# EAGLE design bravo-v2 (EAGLE 9.0.1)

## Sheet 1 of 2
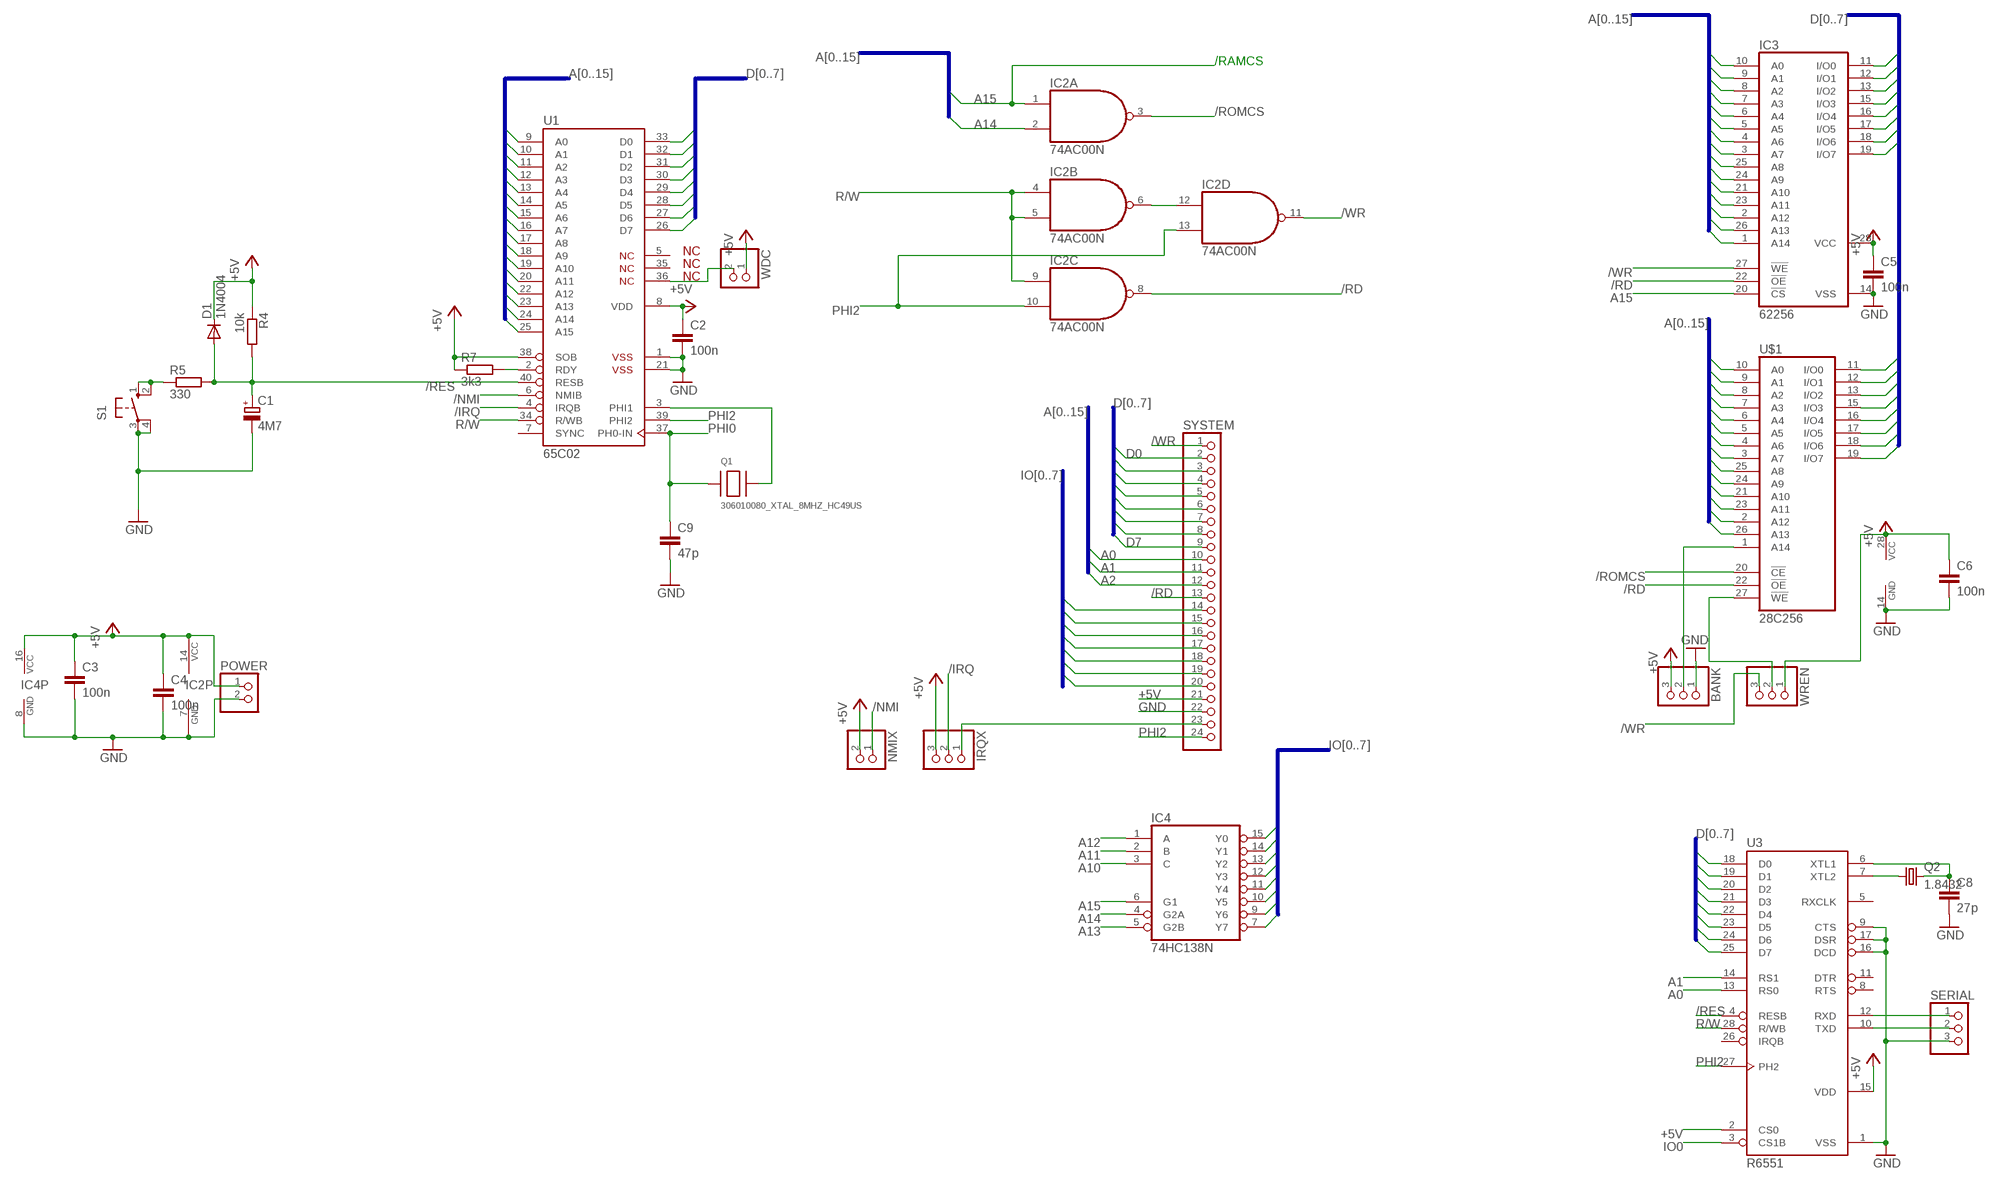
[diagram p0: schematic, sheet 1]

### Parts
BANK  PINHD-1X3  [1X03]
C1  4M7  CPOL-EUE2.5-6  [E2,5-6]
C2  100n  C-EU025-030X050  [C025-030X050]
C3  100n  C-EU025-030X050  [C025-030X050]
C4  100n  C-EU025-030X050  [C025-030X050]
C5  100n  C-EU025-030X050  [C025-030X050]
C6  100n  C-EU025-030X050  [C025-030X050]
C8  27p  C-EU050-030X075  [C050-030X075]
C9  47p  C-EU025-030X050  [C025-030X050]
D1  1N4004  [DO41-10]
IC2  74AC00N  74ALS00N  [DIL14]
IC3  62256  62256P  [DIL28-6]
IC4  74HC138N  [DIL16]
IRQX  PINHD-1X3  [1X03]
NMIX  PINHD-1X2  [1X02]
POWER  PINHD-1X2  [1X02]
Q1  306010080_XTAL_8MHZ_HC49US  [HC49US]
Q2  1.8432  CRYSTALHC49S  [HC49/S]
R4  10k  R-EU_0207/7  [0207/7]
R5  330  R-EU_0207/7  [0207/7]
R7  3k3  R-EU_0207/7  [0207/7]
S1  40-XX  [B3F-40XX]
SERIAL  PINHD-1X3  [1X03]
SYSTEM  PINHD-1X24/90  [1X24/90]
U1  65C02  G65SC02P  [DIP-40]
U3  R6551  G65SC51P  [DIP-28]
U$1  28C256  [DIL28]
WDC  PINHD-1X2  [1X02]
WREN  PINHD-1X3  [1X03]

### Nets
+5V [supply]: BANK.3 C2.1 C3.1 C4.1 C5.1 C6.1 D1.C IC2.14(P:VCC) IC3.28(VCC) IC4.16(VCC) IRQX.3 NMIX.2 POWER.1 R4.1 R7.1 SYSTEM.21 U1.8(VDD) U1.38(SOB) U3.2(CS0) U3.15(VDD) U$1.28(VCC) WDC.1 WREN.1
/IRQ: IRQX.2 U1.4(IRQB)
/NMI: NMIX.1 U1.6(NMIB)
/RD: IC2.8(C:O) IC3.22(!OE) SYSTEM.13 U$1.22(!OE)
/RES: C1.+ D1.A R4.2 R5.2 U1.40(RESB) U3.4(RESB)
/ROMCS: IC2.3(A:O) U$1.20(!CE)
/WR: IC2.11(D:O) IC3.27(!WE) SYSTEM.1 WREN.3
A0: IC3.10(A0) SYSTEM.10 U1.9(A0) U3.13(RS0) U$1.10(A0)
A1: IC3.9(A1) SYSTEM.11 U1.10(A1) U3.14(RS1) U$1.9(A1)
A2: IC3.8(A2) SYSTEM.12 U1.11(A2) U$1.8(A2)
A3: IC3.7(A3) U1.12(A3) U$1.7(A3)
A4: IC3.6(A4) U1.13(A4) U$1.6(A4)
A5: IC3.5(A5) U1.14(A5) U$1.5(A5)
A6: IC3.4(A6) U1.15(A6) U$1.4(A6)
A7: IC3.3(A7) U1.16(A7) U$1.3(A7)
A8: IC3.25(A8) U1.17(A8) U$1.25(A8)
A9: IC3.24(A9) U1.18(A9) U$1.24(A9)
A10: IC3.21(A10) IC4.3(C) U1.19(A10) U$1.21(A10)
A11: IC3.23(A11) IC4.2(B) U1.20(A11) U$1.23(A11)
A12: IC3.2(A12) IC4.1(A) U1.22(A12) U$1.2(A12)
A13: IC3.26(A13) IC4.5(G2B) U1.23(A13) U$1.26(A13)
A14: IC2.2(A:I1) IC3.1(A14) IC4.4(G2A) U1.24(A14)
A15: IC2.1(A:I0) IC3.20(!CS) IC4.6(G1) U1.25(A15)
D0: IC3.11(I/O0) SYSTEM.2 U1.33(D0) U3.18(D0) U$1.11(I/O0)
D1: IC3.12(I/O1) SYSTEM.3 U1.32(D1) U3.19(D1) U$1.12(I/O1)
D2: IC3.13(I/O2) SYSTEM.4 U1.31(D2) U3.20(D2) U$1.13(I/O2)
D3: IC3.15(I/O3) SYSTEM.5 U1.30(D3) U3.21(D3) U$1.15(I/O3)
D4: IC3.16(I/O4) SYSTEM.6 U1.29(D4) U3.22(D4) U$1.16(I/O4)
D5: IC3.17(I/O5) SYSTEM.7 U1.28(D5) U3.23(D5) U$1.17(I/O5)
D6: IC3.18(I/O6) SYSTEM.8 U1.27(D6) U3.24(D6) U$1.18(I/O6)
D7: IC3.19(I/O7) SYSTEM.9 U1.26(D7) U3.25(D7) U$1.19(I/O7)
GND [supply]: BANK.1 C1.- C2.2 C3.2 C4.2 C5.2 C6.2 C8.2 C9.2 IC2.7(P:GND) IC3.14(VSS) IC4.8(GND) POWER.2 S1.3(P) S1.4(P1) SERIAL.3 SYSTEM.22 U1.1(VSS$1) U1.21(VSS$2) U3.1(VSS) U3.9(CTS) U3.16(DCD) U3.17(DSR) U$1.14(GND)
IO0: IC4.15(Y0) U3.3(CS1B)
IO1: IC4.14(Y1) SYSTEM.14
IO2: IC4.13(Y2) SYSTEM.15
IO3: IC4.12(Y3) SYSTEM.16
IO4: IC4.11(Y4) SYSTEM.17
IO5: IC4.10(Y5) SYSTEM.18
IO6: IC4.9(Y6) SYSTEM.19
IO7: IC4.7(Y7) SYSTEM.20
N$1: R5.1 S1.1(S) S1.2(S1)
N$8: U1.36(NC$3) WDC.2
N$9: BANK.2 U$1.1(A14)
N$10: IC2.6(B:O) IC2.12(D:I0)
N$11: R7.2 U1.2(RDY)
N$31: U$1.27(!WE) WREN.2
N$32: IRQX.1 SYSTEM.23
N$33: Q1.P$2 U1.3(PHI1)
N$35: SERIAL.1 U3.12(RXD)
N$36: SERIAL.2 U3.10(TXD)
N$38: Q2.1 U3.7(XTL2)
N$39: C8.1 Q2.2 U3.6(XTL1)
PHI0: C9.1 Q1.P$1 U1.37(PH0-IN)
PHI2: IC2.10(C:I1) IC2.13(D:I1) SYSTEM.24 U1.39(PHI2) U3.27(PH2)
R/W: IC2.4(B:I0) IC2.5(B:I1) IC2.9(C:I0) U1.34(R/WB) U3.28(R/WB)
Unconnected: U1.5(NC$1) U1.7(SYNC) U1.35(NC$2) U3.5(RXCLK) U3.8(RTS) U3.11(DTR) U3.26(IRQB)

### Buses
A[0..15]
D[0..7]
IO[0..7]

### Notes on the sheet
- /RAMCS

## Sheet 2 of 2

## Library data of the parts
BANK IRQX SERIAL WREN = pinhead:PINHD-1X3: PIN HEADER
C1 = rcl:CPOL-EU: POLARIZED CAPACITOR, European symbol
C2-C6 C8 C9 = rcl:C-EU: CAPACITOR, European symbol
D1 = adafruit:1N4004: DIODE General purpose 1N400x type rectifier (With bigger pads) http://www.ladyada.net/library/pcb/eaglelibrary.html
IC2 = 74xx-us:74*00: Quad 2-input NAND gate
IC3 = memory-hitachi:62256P: MEMORY; OC_FARNELL: unknown; OC_NEWARK: unknown
IC4 = 74xx-eu:74*138: 3-line to 8-line DECODER/DEMULTIPLEXER
NMIX POWER WDC = pinhead:PINHD-1X2: PIN HEADER
Q1 = Seeed-OPL-2017-01-Crystal-Akita:306010080_XTAL_8MHZ_HC49US: HC49/US-11.35X4.65X3.6, DIP Crystal 8MHz-20pF-30ppm-80R, SKU: 306010080
Q2 = adafruit:CRYSTAL: CRYSTAL; OC_FARNELL: 1667008; OC_NEWARK: unknown
R4 R5 R7 = rcl:R-EU_: RESISTOR, European symbol
S1 = adafruit:40-XX: OMRON SWITCH; MF: OMRON COMPONENTS USA; MPN: B3F-4000; OC_FARNELL: 176434; OC_NEWARK: 36K3105
SYSTEM = pinhead:PINHD-1X24: PIN HEADER
U1 = 65xxx:G65SC02P: California Micro Devices Version
U3 = 65xxx:G65SC51P: California Micro Devices Version
U$1 = memory:28C256: MEMORY

## Net classes
1 supply: width 0.61 mm

## Board
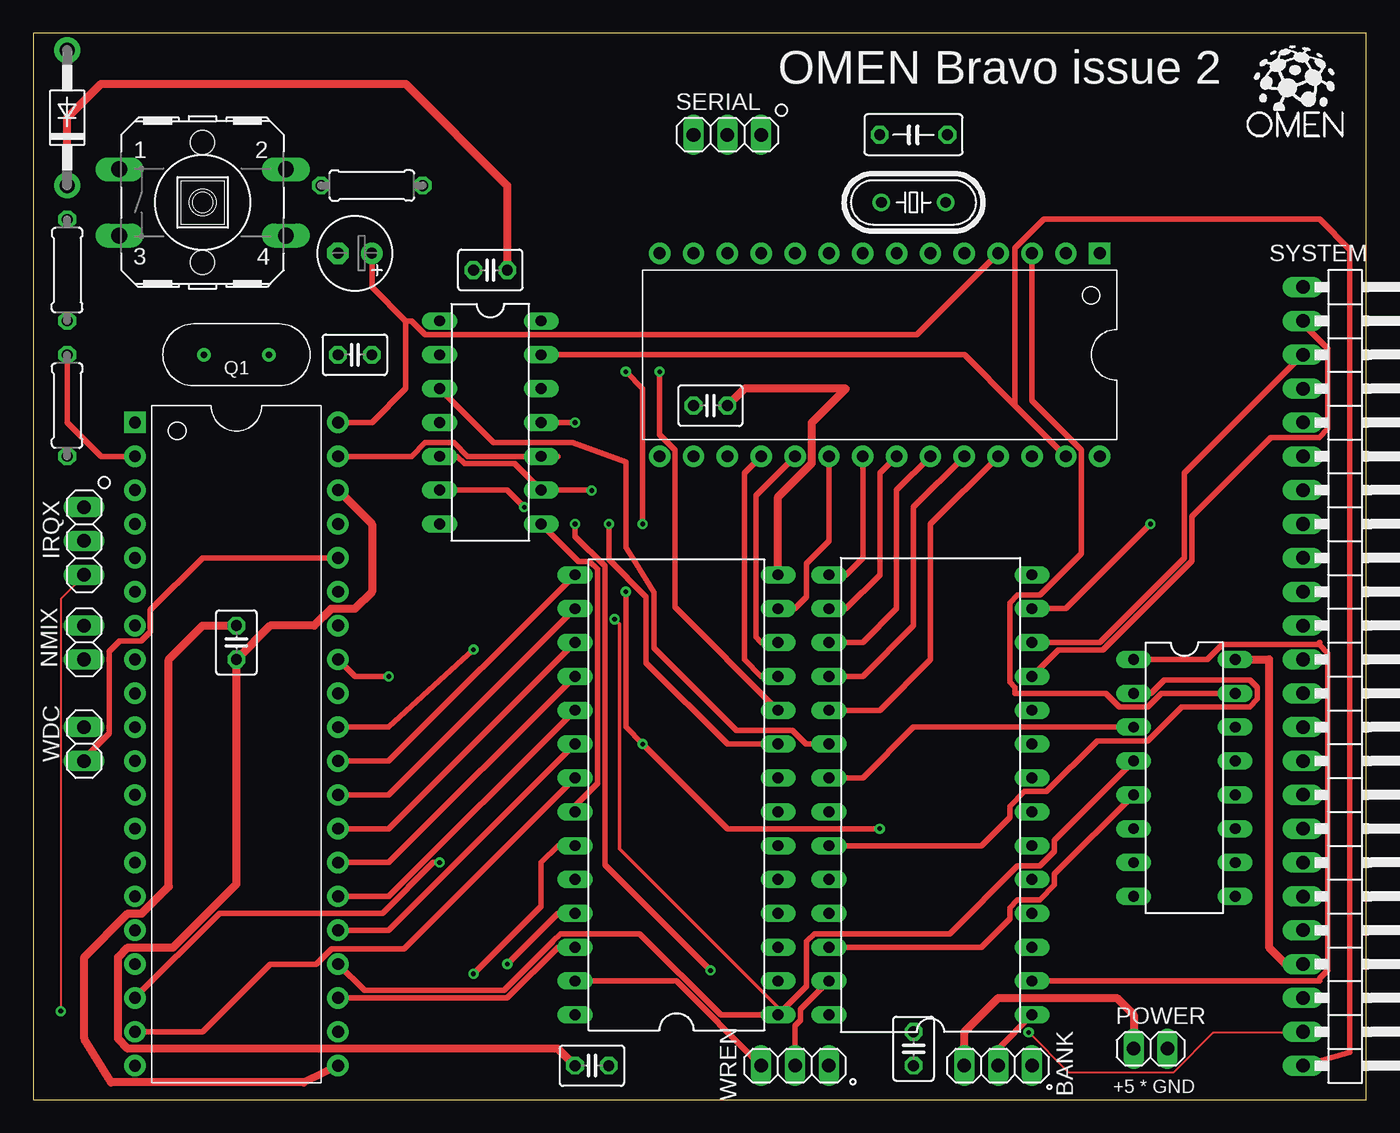
[diagram p1: board, top side]
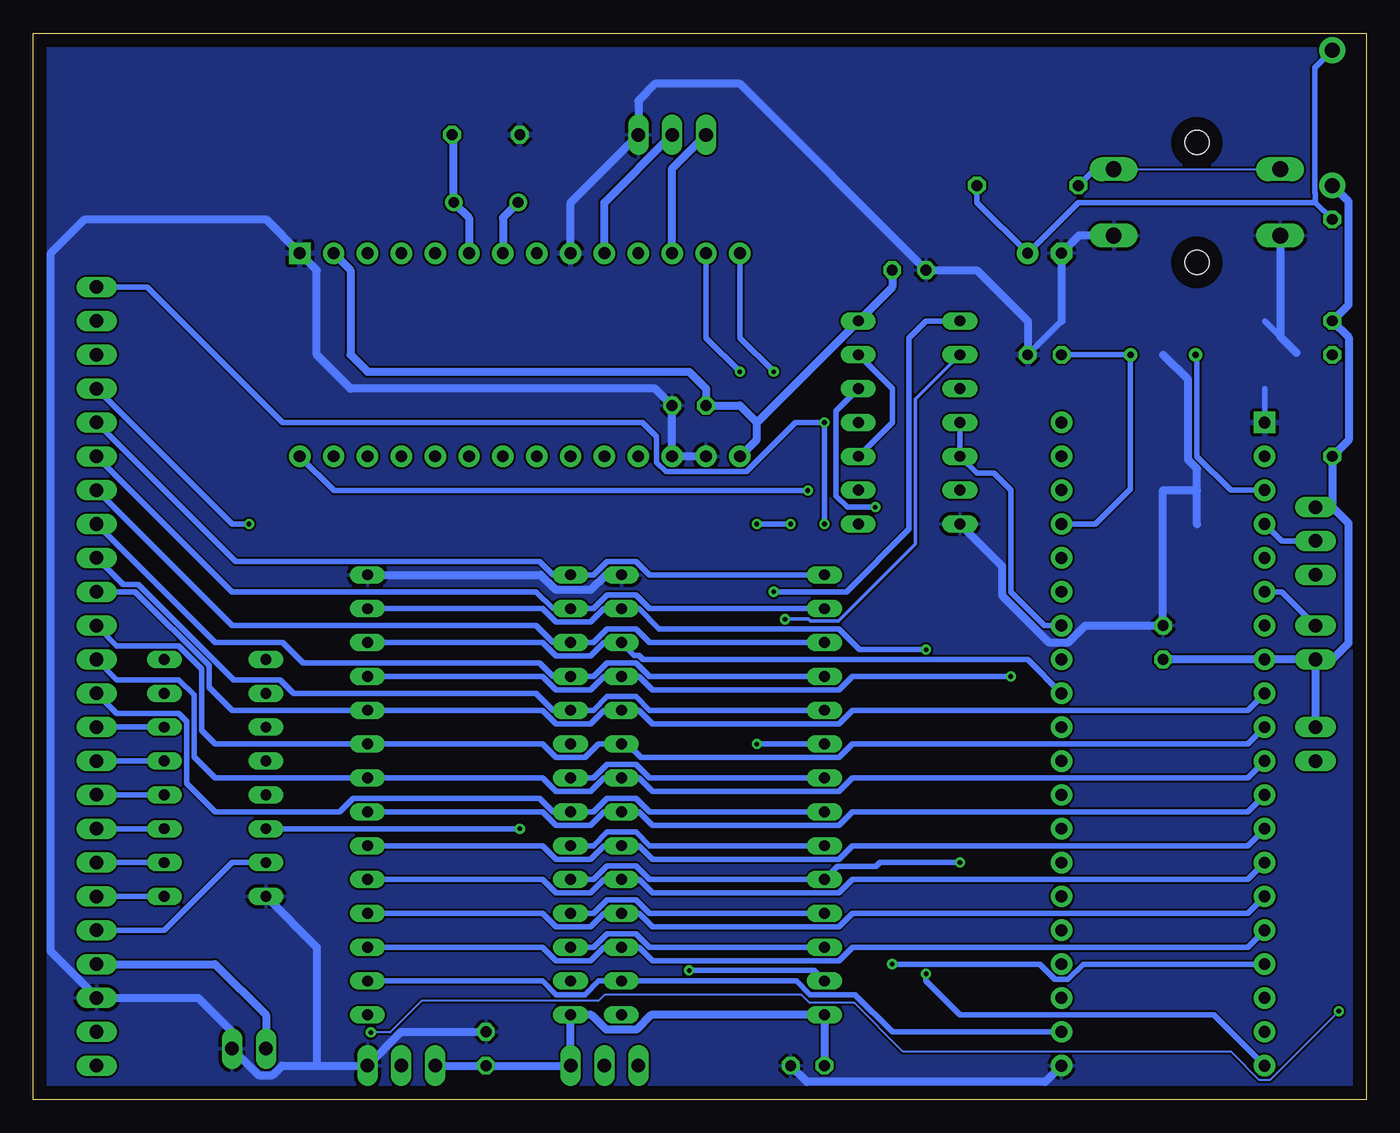
[diagram p2: board, bottom side, seen from below]

Size 100 x 80 mm. Coordinates in mm from the lower left corner, seen from the top.
Outline: 0,0 100,0 100,80 0,80 0,0
Copper layers (1*16): Top 0.035mm / dielectric 1.5mm / Bottom 0.035mm
Design rules "default": minimum track width 6mil, minimum drill 0.35mm, track to track 6mil, track to pad 6mil, pad to pad 6mil, via to via 6mil, smd to smd 6mil, copper to edge 40mil, drill to drill 6mil, minimum pad ring 10mil, minimum via ring 8mil, stop-mask expansion 4mil, vias tented up to drill 0mil, thermal gap 10mil
tRestrict: area 3.8,41.9 to 26.7,59.7

### Footprints (pad centres in the part's own frame; a part is rotated, then mirrored left to right if it is on the bottom)
1X03 = drill 1.016 long: 1 -2.54,0; 2 0,0; 3 2.54,0
E2,5-6 = drill 0.813 pad 1.6: + -1.27,0 | drill 0.813 pad 1.6 octagon: - 1.27,0
C025-030X050 = drill 0.813 octagon: 1 -1.27,0; 2 1.27,0
C050-030X075 = drill 0.813 octagon: 1 -2.54,0; 2 2.54,0
DO41-10 = drill 1.118 pad 1.93: A 5.08,0; C -5.08,0
DIL14 = drill 0.813 long: 1 -7.62,-3.81; 2 -5.08,-3.81; 3 -2.54,-3.81; 4 0,-3.81; 5 2.54,-3.81; 6 5.08,-3.81; 7 7.62,-3.81; 8 7.62,3.81; 9 5.08,3.81; 10 2.54,3.81; 11 0,3.81; 12 -2.54,3.81; 13 -5.08,3.81; 14 -7.62,3.81
DIL28-6 = drill 0.813 long: 1 -16.51,-7.62; 2 -13.97,-7.62; 3 -11.43,-7.62; 4 -8.89,-7.62; 5 -6.35,-7.62; 6 -3.81,-7.62; 7 -1.27,-7.62; 8 1.27,-7.62; 9 3.81,-7.62; 10 6.35,-7.62; 11 8.89,-7.62; 12 11.43,-7.62; 13 13.97,-7.62; 14 16.51,-7.62; 15 16.51,7.62; 16 13.97,7.62; 17 11.43,7.62; 18 8.89,7.62; 19 6.35,7.62; 20 3.81,7.62; 21 1.27,7.62; 22 -1.27,7.62; 23 -3.81,7.62; 24 -6.35,7.62; 25 -8.89,7.62; 26 -11.43,7.62; 27 -13.97,7.62; 28 -16.51,7.62
DIL16 = drill 0.813 long: 1 -8.89,-3.81; 2 -6.35,-3.81; 3 -3.81,-3.81; 4 -1.27,-3.81; 5 1.27,-3.81; 6 3.81,-3.81; 7 6.35,-3.81; 8 8.89,-3.81; 9 8.89,3.81; 10 6.35,3.81; 11 3.81,3.81; 12 1.27,3.81; 13 -1.27,3.81; 14 -3.81,3.81; 15 -6.35,3.81; 16 -8.89,3.81
1X02 = drill 1.016 long: 1 -1.27,0; 2 1.27,0
HC49US = drill 0.5: P$1 -2.44,0; P$2 2.44,0
HC49/S = drill 0.813: 1 -2.413,0; 2 2.413,0
0207/7 = drill 0.813 octagon: 1 -3.81,0; 2 3.81,0
B3F-40XX = drill 1.194 long: 1 -6.248,2.489; 2 6.248,2.489; 3 -6.248,-2.489; 4 6.248,-2.489 | hole 1.803: 0,-4.496; 0,4.496
1X24/90 = drill 1.016 long: 1 -29.21,-3.81; 2 -26.67,-3.81; 3 -24.13,-3.81; 4 -21.59,-3.81; 5 -19.05,-3.81; 6 -16.51,-3.81; 7 -13.97,-3.81; 8 -11.43,-3.81; 9 -8.89,-3.81; 10 -6.35,-3.81; 11 -3.81,-3.81; 12 -1.27,-3.81; 13 1.27,-3.81; 14 3.81,-3.81; 15 6.35,-3.81; 16 8.89,-3.81; 17 11.43,-3.81; 18 13.97,-3.81; 19 16.51,-3.81; 20 19.05,-3.81; 21 21.59,-3.81; 22 24.13,-3.81; 23 26.67,-3.81; 24 29.21,-3.81
DIP-40 = drill 0.889 pad 1.6 square: 1 -22.86,-7.62 | drill 0.889 pad 1.6: 2 -20.32,-7.62; 3 -17.78,-7.62; 4 -15.24,-7.62; 5 -12.7,-7.62; 6 -10.16,-7.62; 7 -7.62,-7.62; 8 -5.08,-7.62; 9 -2.54,-7.62; 10 0,-7.62; 11 2.54,-7.62; 12 5.08,-7.62; 13 7.62,-7.62; 14 10.16,-7.62; 15 12.7,-7.62; 16 15.24,-7.62; 17 17.78,-7.62; 18 20.32,-7.62; 19 22.86,-7.62; 20 25.4,-7.62; 21 25.4,7.62; 22 22.86,7.62; 23 20.32,7.62; 24 17.78,7.62; 25 15.24,7.62; 26 12.7,7.62; 27 10.16,7.62; 28 7.62,7.62; 29 5.08,7.62; 30 2.54,7.62; 31 0,7.62; 32 -2.54,7.62; 33 -5.08,7.62; 34 -7.62,7.62; 35 -10.16,7.62; 36 -12.7,7.62; 37 -15.24,7.62; 38 -17.78,7.62; 39 -20.32,7.62; 40 -22.86,7.62
DIP-28 = drill 0.889 pad 1.6 square: 1 -15.24,-7.62 | drill 0.889 pad 1.6: 2 -12.7,-7.62; 3 -10.16,-7.62; 4 -7.62,-7.62; 5 -5.08,-7.62; 6 -2.54,-7.62; 7 0,-7.62; 8 2.54,-7.62; 9 5.08,-7.62; 10 7.62,-7.62; 11 10.16,-7.62; 12 12.7,-7.62; 13 15.24,-7.62; 14 17.78,-7.62; 15 17.78,7.62; 16 15.24,7.62; 17 12.7,7.62; 18 10.16,7.62; 19 7.62,7.62; 20 5.08,7.62; 21 2.54,7.62; 22 0,7.62; 23 -2.54,7.62; 24 -5.08,7.62; 25 -7.62,7.62; 26 -10.16,7.62; 27 -12.7,7.62; 28 -15.24,7.62
DIL28 = drill 0.813 long: 1 -16.51,-7.62; 2 -13.97,-7.62; 3 -11.43,-7.62; 4 -8.89,-7.62; 5 -6.35,-7.62; 6 -3.81,-7.62; 7 -1.27,-7.62; 8 1.27,-7.62; 9 3.81,-7.62; 10 6.35,-7.62; 11 8.89,-7.62; 12 11.43,-7.62; 13 13.97,-7.62; 14 16.51,-7.62; 15 16.51,7.62; 16 13.97,7.62; 17 11.43,7.62; 18 8.89,7.62; 19 6.35,7.62; 20 3.81,7.62; 21 1.27,7.62; 22 -1.27,7.62; 23 -3.81,7.62; 24 -6.35,7.62; 25 -8.89,7.62; 26 -11.43,7.62; 27 -13.97,7.62; 28 -16.51,7.62

### Placement (x,y rotation side)
BANK  72.39,2.54 180 top
C1  24.13,63.5 180 top
C2  50.8,52.07 0 top
C3  34.29,62.23 180 top
C4  15.24,34.29 90 top
C5  66.04,3.81 90 top
C6  41.91,2.54 0 top
C8  66.04,72.39 180 top
C9  24.13,55.88 0 top
D1  2.54,73.66 90 top
IC2  34.29,50.8 270 top
IC3  48.26,22.86 90 top
IC4  86.36,24.13 270 top
IRQX  3.81,41.91 90 top
NMIX  3.81,34.29 270 top
POWER  83.82,3.81 0 top
Q1  15.24,55.88 180 top
Q2  66.04,67.31 0 top
R4  2.54,62.23 90 top
R5  25.4,68.58 0 top
R7  2.54,52.07 90 top
S1  12.7,67.31 0 top
SERIAL  52.07,72.39 0 top
SYSTEM  99.06,31.75 270 top
U1  15.24,27.94 270 top
U3  64.77,55.88 180 top
U$1  67.31,22.86 90 top
WDC  3.81,26.67 270 top
WREN  57.15,2.54 180 top

### Tracks (layer width: path | path; a pad name or v marks a point on that pad's centre or on a via)
+5V
  Top 0.61: U1.38 25.4,43.18 25.4,38.1 24.12,36.82 22.34,36.82 21.08,35.56 17.78,35.56 C4.1 15.24,16.17 10.48,11.42 7.1,11.42 6.36,10.68 6.36,4.56 7.1,3.82 39.36,3.82 C6.1 | IC4.16 92.71,33.02 92.71,11.43 93.98,10.16 SYSTEM.21 | D1.C 2.54,73.66 5.08,76.2 27.94,76.2 35.56,68.58 C3.1 | BANK.3 69.85,5.08 72.39,7.62 81.28,7.62 82.55,6.35 POWER.1
  Bottom 0.61: NMIX.2 U1.8 C4.1 | NMIX.2 WDC.1 | NMIX.2 2.54,33.02 1.32,34.24 1.32,43.23 2.54,44.45 | 2.54,44.45 IRQX.3 | 2.54,44.45 R7.1 1.32,49.48 1.32,57.2 R4.1 1.32,59.64 1.32,67.36 D1.C | WREN.1 U$1.28 58.12,6.35 57,5.23 54.76,5.23 53.64,6.35 IC3.28 C6.1 | BANK.3 WREN.1 | C5.1 WREN.1 | SYSTEM.21 86.36,10.16 82.55,6.35 POWER.1 | 45.72,50.8 46.99,52.07 C2.1 49.53,53.34 50.8,54.61 74.93,54.61 76.2,55.88 76.2,62.23 U3.2 | U3.15 45.72,49.53 45.72,50.8 | 45.72,50.8 IC2.14 35.56,60.96 C3.1
/IRQ
  Bottom 0.406: IRQX.2 6.35,41.91 U1.4
/NMI
  Bottom 0.406: U1.6 6.35,38.1 NMIX.1
/RD
  Top 0.406: IC3.22 40.64,22.03 42.32,23.71 42.32,39.79 41.72,40.39 40.89,40.39 IC2.8
  Bottom 0.406: IC3.22 53.78,21.59 54.8,22.61 56.96,22.61 57.98,21.59 U$1.22 61,21.59 62.01,22.61 76.01,22.61 77.03,21.59 86.36,21.59 88.49,23.72 88.49,28.36 89.09,28.96 93.73,28.96 SYSTEM.13
/RES
  Top 0.406: C1.+ 25.4,60.96 27.94,58.42 | 27.94,58.42 27.94,53.34 25.4,50.8 U1.40 | 27.94,58.42 28.38,58.42 29.4,57.4 66.29,57.4 U3.4
  Bottom 0.406: 3.81,67.31 3.81,67.98 3.86,68.03 3.86,77.42 D1.A | 3.81,67.31 R4.2 | 3.81,67.31 21.59,67.31 C1.+ 29.21,67.31 R5.2
/ROMCS
  Top 0.406: U$1.20 57.98,26.67 56.96,27.69 52.77,27.69 46.58,33.87 46.58,38.03 45.16,40.29 44.45,41.43 44.45,47.82 40.45,49.28 34.54,49.28 IC2.3
/WR  (via drill 0.35)
  Top 0.406: IC3.27 48.26,8.89 WREN.3 | v40.64,43.18 40.64,42.26 42.88,40.02 42.88,17.61 v50.8,9.68 | v40.64,50.8 IC2.11
  Bottom 0.406: IC3.27 41.43,9.68 v50.8,9.68 | v40.64,43.18 v40.64,50.8 42.82,50.8 46.51,47.1 52.55,47.1 53.23,47.78 53.23,49.73 54.3,50.8 81.28,50.8 91.44,60.96 SYSTEM.1
A0  (via drill 0.35)
  Top 0.406: v46.99,54.61 46.99,49.89 48.15,48.74 48.15,36.94 IC3.10
  Bottom 0.406: U1.9 8.89,29.21 38.54,29.21 39.56,28.19 53.56,28.19 54.57,29.21 IC3.10 57.19,29.21 58.2,28.19 60.77,28.19 61.79,29.21 U$1.10 85.09,29.21 86.82,30.94 86.82,32.55 92.36,38.1 SYSTEM.10 | v46.99,54.61 49.53,57.15 U3.13
A1  (via drill 0.35)
  Top 0.406: v44.45,54.61 45.72,53.34 v45.72,43.18 | v43.18,43.18 43.18,40.51 45.97,37.71 45.97,32.77 52.07,26.67 IC3.9
  Bottom 0.406: U1.10 8.89,26.67 38.54,26.67 39.56,25.65 54.42,25.65 55.44,26.67 IC3.9 57.59,26.67 58.61,25.65 60.77,25.65 61.79,26.67 U$1.9 86.36,26.67 87.38,27.69 87.38,32.32 89.09,34.04 93.73,34.04 SYSTEM.11 | U3.14 46.99,57.15 v44.45,54.61 | v45.72,43.18 v43.18,43.18
A2
  Bottom 0.406: U1.11 8.89,24.13 38.54,24.13 39.56,23.11 53.56,23.11 54.57,24.13 IC3.8 57.19,24.13 58.2,23.11 60.77,23.11 61.79,24.13 U$1.8 86.36,24.13 87.94,25.7 87.94,30.34 89.09,31.5 93.73,31.5 SYSTEM.12
A3
  Bottom 0.406: U$1.7 61.79,21.59 60.77,20.57 58.2,20.57 57.19,21.59 IC3.7 54.57,21.59 53.56,20.57 39.56,20.57 38.54,21.59 8.89,21.59 U1.12
A4
  Bottom 0.406: U$1.6 61.79,19.05 60.77,18.03 58.2,18.03 57.19,19.05 IC3.6 54.57,19.05 53.56,18.03 39.56,18.03 38.54,19.05 8.89,19.05 U1.13
A5
  Bottom 0.406: U$1.5 61.79,16.51 60.77,15.49 58.2,15.49 57.19,16.51 IC3.5 54.57,16.51 53.56,15.49 39.56,15.49 38.54,16.51 8.89,16.51 U1.14
A6
  Bottom 0.406: U$1.4 61.79,13.97 60.77,12.95 58.2,12.95 57.19,13.97 IC3.4 54.57,13.97 53.56,12.95 39.56,12.95 38.54,13.97 8.89,13.97 U1.15
A7
  Bottom 0.406: U$1.3 61.79,11.43 60.77,10.41 58.2,10.41 57.19,11.43 IC3.3 54.57,11.43 53.56,10.41 39.56,10.41 38.54,11.43 8.89,11.43 U1.16
A8  (via drill 0.35)
  Top 0.406: IC3.25 39.37,13.97 v35.56,10.16
  Bottom 0.406: IC3.25 53.78,13.97 54.8,14.99 56.96,14.99 57.98,13.97 U$1.25 | U1.17 21.23,10.16 22.38,9 23.34,9 24.49,10.16 v35.56,10.16
A9  (via drill 0.35)
  Top 0.406: U1.18 13.97,13.97 26.19,13.97 30,17.78 v30.48,17.78
  Bottom 0.406: v30.48,17.78 36.48,17.78 36.79,17.48 39.67,17.48 IC3.24 53.78,16.51 54.8,17.53 56.96,17.53 57.98,16.51 U$1.24
A10
  Top 0.406: IC3.21 27.83,11.32 22.38,11.32 21.23,10.16 17.78,10.16 12.7,5.08 U1.19 | IC4.3 66.04,27.94 62.23,24.13 U$1.21
  Bottom 0.406: IC3.21 53.78,24.13 54.8,25.15 56.96,25.15 57.98,24.13 U$1.21
A11  (via drill 0.35)
  Top 0.406: v33.02,9.43 38.1,14.51 38.1,17.78 39.37,19.05 IC3.23 | U$1.23 71.12,19.05 73.25,21.18 73.25,22.01 74.36,23.11 76.01,23.11 79.82,26.92 83.63,26.92 86.17,29.46 91.25,29.46 91.85,30.06 91.85,30.9 91.25,31.5 84.87,31.5 83.86,30.48 IC4.2
  Bottom 0.406: IC3.23 53.78,19.05 54.8,20.07 56.96,20.07 57.98,19.05 U$1.23 | U1.20 11.43,6.35 30.48,6.35 33.02,8.89 v33.02,9.43
A12
  Top 0.406: IC4.1 88.07,33.02 89.19,34.14 96.37,34.14 96.52,34.29 96.52,34.09 97.13,33.48 97.13,9.7 96.52,9.09 96.52,8.89 U$1.2
  Bottom 0.406: U$1.2 61.79,8.89 60.77,7.87 58.61,7.87 57.59,8.89 IC3.2 42.74,8.89 41.72,7.87 38.35,7.87 35.56,5.08 U1.22
A13
  Top 0.406: IC3.26 39.37,11.43 35.56,7.62 U1.23 | U$1.26 71.12,11.43 73.25,13.56 73.25,14.39 73.85,14.99 75.5,14.99 76.61,16.09 76.61,16.92 IC4.5
  Bottom 0.406: IC3.26 53.78,11.43 54.8,12.45 56.96,12.45 57.98,11.43 U$1.26
A14  (via drill 0.35)
  Top 0.254: v43.61,36.04 43.97,35.68 43.97,18.81 55.88,6.9 IC3.1
  Top 0.406: U1.24 24.84,8.18 35.33,8.18 38.96,11.81 38.96,11.85 39.56,12.45 45.49,12.45 51.59,6.35 IC3.1 58.01,8.48 58.01,11.85 58.61,12.45 68.77,12.45 73.85,17.53 75.5,17.53 76.61,18.63 76.61,19.46 IC4.4
  Bottom 0.254: IC2.2 33.81,52.55 33.81,41.67 39.59,35.89 41.69,35.89 41.84,36.04 v43.61,36.04
A15  (via drill 0.35)
  Top 0.406: IC3.20 26.67,12.7 U1.25 | v63.5,20.32 52.07,20.32 v45.72,26.67 44.45,27.94 v44.45,38.1
  Bottom 0.406: IC4.6 v63.5,20.32 | v45.72,26.67 IC3.20 | IC2.1 33.02,58.42 34.29,57.15 34.29,42.82 39.01,38.1 v44.45,38.1
D0  (via drill 0.35)
  Top 0.406: v26.67,31.75 24.13,31.75 U1.33 | U3.18 53.34,46.99 53.34,33.02 54.61,31.75 IC3.11 | U$1.11 76.91,33.73 80.24,33.73 86.92,40.41 86.92,43.74 92.86,49.68 96.47,49.68 97.13,50.34 97.13,56.34 95.25,58.22 SYSTEM.2
  Bottom 0.406: U$1.11 61.79,31.75 60.77,30.73 58.2,30.73 57.19,31.75 IC3.11 54.57,31.75 53.56,30.73 39.56,30.73 38.54,31.75 v26.67,31.75
D1
  Top 0.406: SYSTEM.3 86.36,46.99 86.36,40.64 80.01,34.29 U$1.12 | U3.19 54.2,45.31 54.2,34.7 54.61,34.29 IC3.12
  Bottom 0.406: U$1.12 61.79,34.29 60.77,33.27 58.2,33.27 57.19,34.29 IC3.12 54.91,33.33 54.57,33.33 54.26,33.02 25.4,33.02 U1.32 | SYSTEM.3 93.98,55.88
D2  (via drill 0.35)
  Top 0.406: v33.02,33.75 26.67,27.94 U1.31 | v83.82,43.18 77.47,36.83 U$1.13 | U3.20 59.69,41.91 58.01,40.23 58.01,37.69 57.15,36.83 IC3.13
  Bottom 0.406: v33.02,33.75 38.01,33.75 39.56,35.31 53.05,35.31 54.57,36.83 IC3.13 57.19,36.83 58.2,35.81 60.77,35.81 61.79,36.83 U$1.13 | SYSTEM.4 85.09,43.18 v83.82,43.18
D3
  Top 0.406: U1.30 26.67,25.4 IC3.15 | U3.21 62.23,40.64 60.96,39.37 U$1.15
  Bottom 0.406: IC3.15 53.78,39.37 54.8,40.39 56.96,40.39 57.98,39.37 U$1.15 61,39.37 62.01,40.39 84.84,40.39 SYSTEM.5
D4
  Top 0.406: IC3.16 26.67,22.86 U1.29 | U3.22 63.5,46.99 63.5,39.37 60.96,36.83 U$1.16
  Bottom 0.406: IC3.16 53.78,36.83 54.8,37.85 56.96,37.85 57.98,36.83 U$1.16 61,36.83 62.27,38.1 85.09,38.1 SYSTEM.6
D5
  Top 0.406: IC3.17 26.67,20.32 U1.28 | U3.23 64.77,45.72 64.77,36.83 62.23,34.29 U$1.17
  Bottom 0.406: IC3.17 53.78,34.29 54.8,35.31 56.96,35.31 57.98,34.29 U$1.17 61,34.29 62.27,35.56 85.09,35.56 SYSTEM.7
D6
  Top 0.406: IC3.18 26.67,17.78 U1.27 | U3.24 66.04,44.45 66.04,35.56 62.23,31.75 U$1.18
  Bottom 0.406: IC3.18 53.78,31.75 54.8,32.77 56.96,32.77 57.98,31.75 U$1.18 61,31.75 62.01,32.77 79.76,32.77 81.28,34.29 86.36,34.29 SYSTEM.8
D7
  Top 0.406: IC3.19 26.67,15.24 U1.26 | U3.25 67.31,43.18 67.31,33.02 63.5,29.21 U$1.19
  Bottom 0.406: IC3.19 53.78,29.21 54.8,30.23 56.96,30.23 57.98,29.21 U$1.19 61,29.21 62.23,30.44 62.23,30.48 80.45,30.48 81.47,31.5 84.97,31.5 92.13,38.66 93.27,38.66 SYSTEM.9
GND
  Top 0.61: IC3.14 55.88,45.21 58.41,47.74 58.41,50.79 60.96,53.34 53.34,53.34 C2.2 | U1.21 20.31,1.28 5.83,1.28 3.82,4.56 3.82,10.68 7.1,13.96 8.14,13.96 10.16,15.98 10.16,33.02 12.7,35.56 C4.2
  Bottom 0.406: U1.1 7.62,53.34 | 5.21,56.01 7.62,58.42 | 22.86,58.42 C9.2
  Bottom 0.61: S1.3 6.45,57.25 5.21,56.01 | S1.4 21.54,64.82 C1.- 22.86,58.42 | 12.7,43.18 12.7,45.72 | 12.7,45.72 12.7,47.33 13.36,47.99 13.36,54 15.24,55.88 | 12.7,45.72 15.24,45.72 C4.2 21.08,35.56 22.34,34.3 23.81,34.3 27.33,37.83 27.33,40.03 IC2.7 | IC3.14 57.04,39.37 58.16,38.25 60.81,38.25 61.93,39.37 U$1.14 | U1.21 24.08,1.32 41.96,1.32 C6.2 | C9.2 25.4,58.42 29.21,62.23 C3.2 46.99,76.2 53.34,76.2 54.61,74.93 SERIAL.3 59.69,67.31 U3.9 | 78.74,2.54 81.33,2.54 82.05,1.83 83.11,1.83 POWER.2 85.09,5.08 87.63,7.62 SYSTEM.22 95.25,7.67 98.68,11.1 98.68,63.5 96.14,66.04 82.55,66.04 U3.1 78.74,62.23 78.74,55.88 76.2,53.34 53.34,53.34 C2.2 U3.17 U3.16 | 78.74,2.54 BANK.1 72.39,5.08 C5.2 | IC4.8 78.74,11.43 78.74,2.54
  pour Bottom: 3.81,54.61 3.81,57.15 6.35,59.69 25.4,59.69 26.67,58.42 26.67,54.61 25.4,53.34 25.4,43.18 24.13,41.91 11.43,41.91 8.89,44.45 6.35,44.45 5.08,45.72 5.08,53.34
  pour Bottom: 60.96,73.66 76.2,73.66 81.28,68.58 81.28,60.96 78.74,58.42 60.96,58.42 58.42,60.96 58.42,71.12
  pour Bottom: 0,80.01 100.33,80.01 100.33,0 0,0
IO0
  Top 0.406: IC4.15 84.65,30.48 83.63,29.46 81.47,29.46 80.45,30.48 73.66,30.48 73.66,30.92 73.25,31.33 73.25,37.25 73.85,37.85 75.5,37.85 78.63,40.97 78.63,48.74 74.93,52.43 U3.3
IO1
  Bottom 0.406: IC4.14 SYSTEM.14
IO2
  Bottom 0.406: SYSTEM.15 IC4.13
IO3
  Bottom 0.406: SYSTEM.16 IC4.12
IO4
  Bottom 0.406: SYSTEM.17 IC4.11
IO5
  Bottom 0.406: SYSTEM.18 IC4.10
IO6
  Bottom 0.406: SYSTEM.19 IC4.9
IO7
  Bottom 0.406: IC4.7 85.09,17.78 90.17,12.7 SYSTEM.20
N$1
  Bottom 0.152: S1.2 S1.1
  Bottom 0.406: S1.2 20.37,69.8 R5.1
N$8
  Top 0.406: WDC.2 3.81,25.6 5.69,27.48 5.69,33.63 6.46,34.4 8.1,34.4 8.78,35.08 8.78,36.72 12.7,40.64 U1.36
N$9
  Top 0.406: BANK.2 72.39,3.81 U$1.1
N$10  (via drill 0.35)
  Top 0.406: IC2.6 35.56,45.72 v36.83,44.45
  Bottom 0.406: IC2.12 39.78,51.66 39.78,45.3 38.93,44.45 v36.83,44.45
N$11
  Top 0.406: U1.2 5.08,48.26 2.54,50.8 R7.2
N$31
  Top 0.406: WREN.2 57.15,5.52 57.56,5.93 57.56,6.76 U$1.27
N$32  (via drill 0.35)
  Top 0.152: v74.68,5.03 77.65,2.06 85.57,2.06 88.54,5.03 95.25,5.03 SYSTEM.23 | v2.06,6.63 2.06,37.57 3.81,39.32 IRQX.1
  Bottom 0.152: v74.68,5.03 73.23,5.03 70.87,7.39 57.61,7.39 57.15,7.85 42.37,7.85 41.76,7.24 38.41,7.24 34.75,3.58 10.13,3.58 8,1.45 7.24,1.45 v2.06,6.63
N$33
  Bottom 0.406: Q1.P$2 12.7,55.78 12.7,48.26 10.16,45.72 U1.3
N$35
  Bottom 0.61: U3.12 52.07,69.85 SERIAL.1
N$36
  Bottom 0.61: U3.10 57.15,67.31 SERIAL.2
N$38
  Bottom 0.61: Q2.1 64.77,66.17 U3.7
N$39
  Bottom 0.61: U3.6 67.31,66.17 Q2.2 68.45,72.26 C8.1
PHI0
  Bottom 0.406: U1.37 20.32,43.18 17.68,45.82 Q1.P$1 C9.1
PHI2
  Top 0.406: U1.39 28.38,48.26 29.4,49.28 31.56,49.28 32.58,48.26 IC2.10 39.37,48.26 | U3.27 73.66,52.07 | 73.66,52.07 69.85,55.88 IC2.13 | SYSTEM.24 98.78,3.53 98.78,63.78 96.52,66.04 75.84,66.04 73.66,63.86 73.66,52.07
  Bottom 0.406: IC2.10 35.56,50.8 35.56,53.34 IC2.13
R/W  (via drill 0.35)
  Top 0.406: v41.89,45.7 41.87,45.72 IC2.9 36.12,47.7 32.35,47.7 31.79,48.26 IC2.5
  Bottom 0.406: U1.34 24.13,35.56 26.67,38.1 26.67,45.72 27.94,46.99 29.21,46.99 IC2.5 IC2.4 | U3.28 77.45,45.7 v41.89,45.7

### Text on the board
tNames: OMEN Bravo issue 2 | +5 * GND